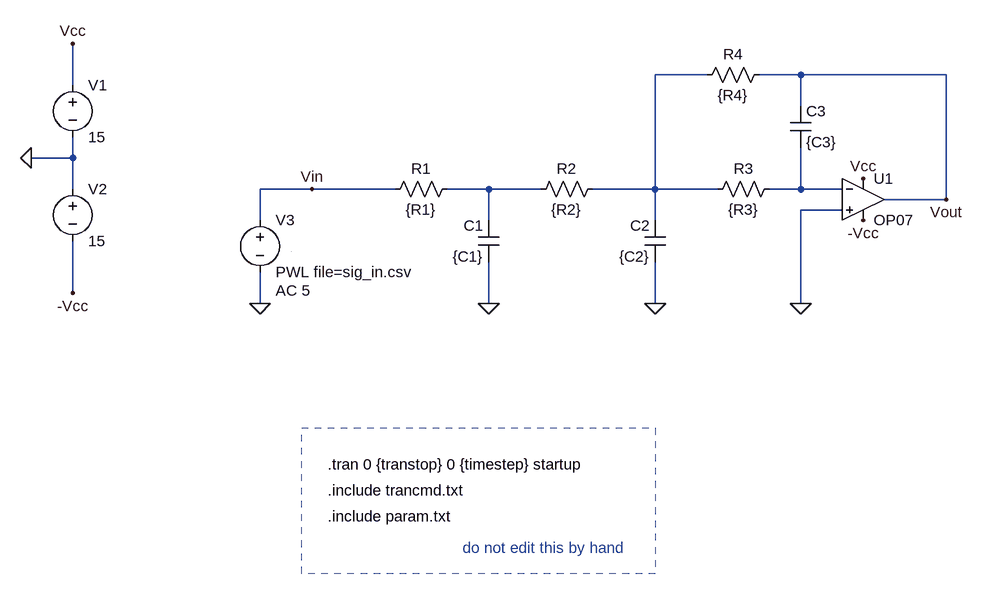
[diagram p0: schematic A9_BajaMFF_3.asc]
A9_BajaMFF_3.asc, the LTspice schematic file:
Version 4
SHEET 1 1052 680
WIRE 640 -272 560 -272
WIRE 784 -272 720 -272
WIRE 1008 -272 784 -272
WIRE -336 -256 -336 -320
WIRE 784 -224 784 -272
WIRE -336 -144 -336 -176
WIRE -336 -144 -400 -144
WIRE -336 -96 -336 -144
WIRE 32 -96 -48 -96
WIRE 160 -96 32 -96
WIRE 304 -96 240 -96
WIRE 384 -96 304 -96
WIRE 560 -96 560 -272
WIRE 560 -96 464 -96
WIRE 656 -96 560 -96
WIRE 784 -96 784 -160
WIRE 784 -96 736 -96
WIRE 848 -96 784 -96
WIRE 1008 -80 1008 -272
WIRE 1008 -80 912 -80
WIRE 848 -64 784 -64
WIRE -48 -48 -48 -96
WIRE 304 -48 304 -96
WIRE 560 -48 560 -96
WIRE -336 64 -336 -16
WIRE -48 80 -48 32
WIRE 304 80 304 16
WIRE 560 80 560 16
WIRE 784 80 784 -64
WIRE 0 0 0 0
FLAG 32 -96 Vin
FLAG -400 -144 0
FLAG -336 -320 Vcc
FLAG -336 64 -Vcc
FLAG -48 80 0
FLAG 560 80 0
FLAG 880 -112 Vcc
FLAG 880 -48 -Vcc
FLAG 1008 -80 Vout
FLAG 784 80 0
FLAG 304 80 0
SYMBOL res 144 -80 R270
WINDOW 0 32 56 VTop 2
WINDOW 3 0 56 VBottom 2
SYMATTR InstName R1
SYMATTR Value {R1}
SYMBOL cap 320 16 R180
WINDOW 0 24 56 Left 2
WINDOW 3 24 8 Left 2
SYMATTR InstName C1
SYMATTR Value {C1}
SYMBOL OpAmps\\OP07 880 -144 R0
SYMATTR InstName U1
SYMBOL cap 576 16 R180
WINDOW 0 24 56 Left 2
WINDOW 3 24 8 Left 2
SYMATTR InstName C2
SYMATTR Value {C2}
SYMBOL voltage -336 -272 R0
WINDOW 123 0 0 Left 0
WINDOW 39 0 0 Left 0
SYMATTR InstName V1
SYMATTR Value 15
SYMBOL voltage -336 -112 R0
WINDOW 123 0 0 Left 0
WINDOW 39 0 0 Left 0
SYMATTR InstName V2
SYMATTR Value 15
SYMBOL voltage -48 -64 R0
WINDOW 123 24 124 Left 2
WINDOW 39 0 0 Left 0
SYMATTR Value2 AC 5
SYMATTR InstName V3
SYMATTR Value PWL file=sig_in.csv
SYMBOL res 368 -80 R270
WINDOW 0 32 56 VTop 2
WINDOW 3 0 56 VBottom 2
SYMATTR InstName R2
SYMATTR Value {R2}
SYMBOL cap 768 -224 R0
SYMATTR InstName C3
SYMATTR Value {C3}
SYMBOL res 640 -80 R270
WINDOW 0 32 56 VTop 2
WINDOW 3 0 56 VBottom 2
SYMATTR InstName R3
SYMATTR Value {R3}
SYMBOL res 624 -256 R270
WINDOW 0 32 56 VTop 2
WINDOW 3 0 56 VBottom 2
SYMATTR InstName R4
SYMATTR Value {R4}
TEXT 56 328 Left 2 !.tran 0 {transtop} 0 {timestep} startup
TEXT 56 408 Left 2 !.include param.txt
TEXT 56 368 Left 2 !.include trancmd.txt
TEXT 264 456 Left 2 ;do not edit this by hand
RECTANGLE Normal 560 496 16 272 2

The netlist it stands for:
* A9_BajaMFF_3.asc
R1 Vin N002 {R1}
C1 0 N002 {C1}
XU1 0 N003 Vcc -Vcc Vout LT1001  ; OP07, pins In+ In- V+ V- OUT
C2 0 N001 {C2}
V1 Vcc 0 15
V2 0 -Vcc 15
V3 Vin 0 PWL file=sig_in.csv AC 5
R2 N002 N001 {R2}
C3 Vout N003 {C3}
R3 N001 N003 {R3}
R4 N001 Vout {R4}
.tran 0 {transtop} 0 {timestep} startup
.include param.txt
.include trancmd.txt
* do not edit this by hand
.lib LTC.lib
.backanno
.end

* Results of the author's LTspice run, read from the files saved beside the schematic
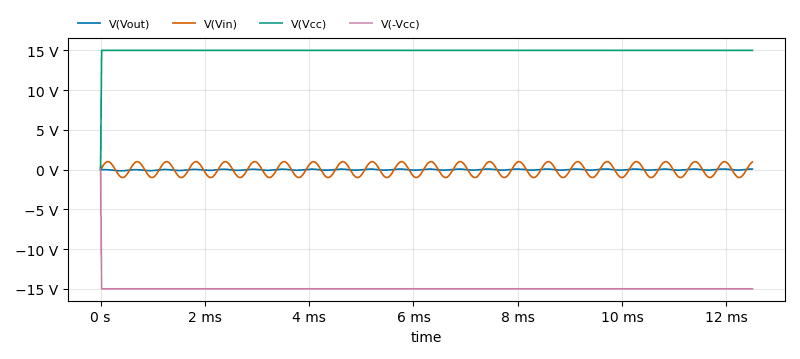
[diagram p1: Transient Analysis of A9_BajaMFF_3.asc, plotted from the saved traces]
* Transient Analysis, 1 run:
*   V(Vout): min -158 mV, max 408.3 mV, average -15.02 mV, rms 55.38 mV, last 67.11 mV
*   V(Vin): min -1 V, max 999.5 mV, average 4.873 mV, rms 705.9 mV, last 947.4 mV
*   V(Vcc): min 0 V, max 15 V, average 14.99 V, rms 14.99 V, last 15 V
*   V(-Vcc): min -15 V, max 0 V, average -14.99 V, rms 14.99 V, last -15 V